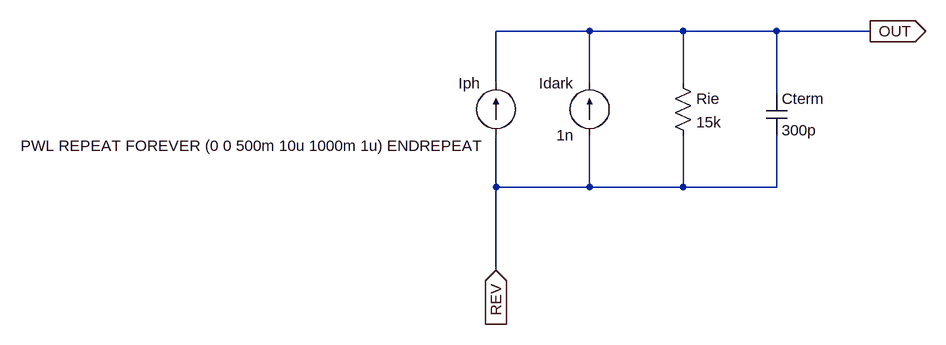
[diagram p0: schematic psd.asc]
psd.asc, the LTspice schematic file:
Version 4
SHEET 1 880 680
WIRE 176 112 32 112
WIRE 320 112 176 112
WIRE 464 112 320 112
WIRE 608 112 464 112
WIRE 32 192 32 112
WIRE 176 192 176 112
WIRE 320 192 320 112
WIRE 464 208 464 112
WIRE 32 352 32 272
WIRE 176 352 176 272
WIRE 176 352 32 352
WIRE 320 352 320 272
WIRE 320 352 176 352
WIRE 464 352 464 272
WIRE 464 352 320 352
WIRE 32 480 32 352
FLAG 608 112 OUT
IOPIN 608 112 Out
FLAG 32 480 REV
IOPIN 32 480 In
SYMBOL current 32 272 R180
WINDOW 0 24 80 Left 2
WINDOW 3 17 -16 Left 2
SYMATTR InstName Iph
SYMATTR Value PWL REPEAT FOREVER (0 0 500m 10u 1000m 1u) ENDREPEAT
SYMBOL current 176 272 R180
WINDOW 0 24 80 Left 2
WINDOW 3 24 0 Left 2
SYMATTR InstName Idark
SYMATTR Value 1n
SYMBOL res 304 176 R0
SYMATTR InstName Rie
SYMATTR Value 15k
SYMBOL cap 448 208 R0
SYMATTR InstName Cterm
SYMATTR Value 300p

The netlist it stands for:
* psd.asc
Iph REV OUT PWL REPEAT FOREVER (0 0 500m 10u 1000m 1u) ENDREPEAT
Idark REV OUT 1n
Rie OUT REV 15k
Cterm OUT REV 300p
.backanno
.end